# Altium schematic sheet STM.SchDoc
size A4
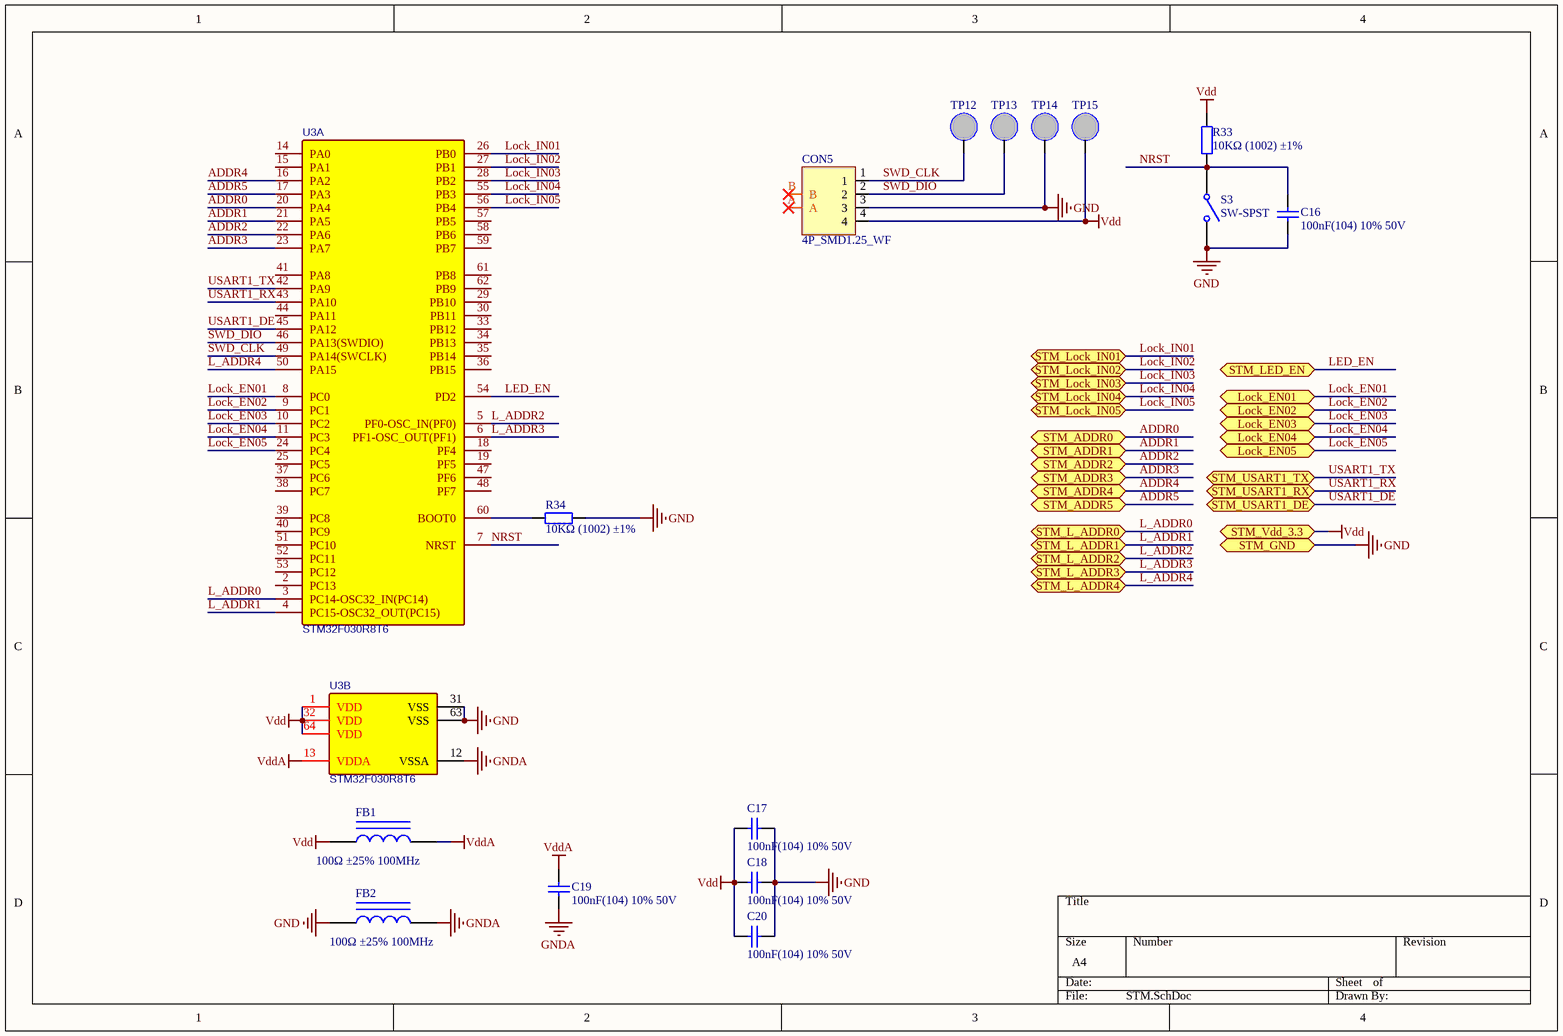
[diagram p0: STM.SchDoc]

## Parts
C16  100nF(104) 10% 50V  [0805_C]
C17  100nF(104) 10% 50V  [0805_C]
C18  100nF(104) 10% 50V  [0805_C]
C19  100nF(104) 10% 50V  [0805_C]
C20  100nF(104) 10% 50V  [0805_C]
CON5  4P_SMD1.25_WF  [MX 1.25-LS-4P]
FB1  100Ω ±25% 100MHz  [0805_L]
FB2  100Ω ±25% 100MHz  [0805_L]
R33  10KΩ (1002) ±1%  [0805_R]
R34  10KΩ (1002) ±1%  [0805_R]
S3  SW-SPST  [key]
TP12  TP  [TP]  (value not drawn)
TP13  TP  [TP]  (value not drawn)
TP14  TP  [TP]  (value not drawn)
TP15  TP  [TP]  (value not drawn)
U3  STM32F030R8T6  [LQFP-64_10X10X05P]  (parts A,B of 2)

## Ports
Lock_EN01, Lock_EN02, Lock_EN03, Lock_EN04, Lock_EN05, STM_ADDR0, STM_ADDR1, STM_ADDR2, STM_ADDR3, STM_ADDR4, STM_ADDR5, STM_GND, STM_L_ADDR0, STM_L_ADDR1, STM_L_ADDR2, STM_L_ADDR3, STM_L_ADDR4, STM_LED_EN, STM_Lock_IN01, STM_Lock_IN02, STM_Lock_IN03, STM_Lock_IN04, STM_Lock_IN05, STM_USART1_DE, STM_USART1_RX, STM_USART1_TX, STM_Vdd_3.3

## Nets
GND: C16.1 C17.1 C18.1 C20.1 CON5.3 FB2.1 R34.2 S3.2(NO) TP14.1 U3.31(VSS) U3.63(VSS) ; port STM_GND
GNDA: C19.1 FB2.2 U3.12(VSSA)
Vdd: C17.2 C18.2 C20.2 CON5.4 FB1.1 R33.2 TP15.1 U3.1(VDD) U3.32(VDD) U3.64(VDD) ; port STM_Vdd_3.3
VddA: C19.2 FB1.2 U3.13(VDDA)
ADDR0: U3.20(PA4) ; port STM_ADDR0
ADDR1: U3.21(PA5) ; port STM_ADDR1
ADDR2: U3.22(PA6) ; port STM_ADDR2
ADDR3: U3.23(PA7) ; port STM_ADDR3
ADDR4: U3.16(PA2) ; port STM_ADDR4
ADDR5: U3.17(PA3) ; port STM_ADDR5
L_ADDR0: U3.3(PC14-OSC32_IN(PC14)) ; port STM_L_ADDR0
L_ADDR1: U3.4(PC15-OSC32_OUT(PC15)) ; port STM_L_ADDR1
L_ADDR2: U3.5(PF0-OSC_IN(PF0)) ; port STM_L_ADDR2
L_ADDR3: U3.6(PF1-OSC_OUT(PF1)) ; port STM_L_ADDR3
L_ADDR4: U3.50(PA15) ; port STM_L_ADDR4
LED_EN: U3.54(PD2) ; port STM_LED_EN
Lock_EN01: U3.8(PC0) ; port Lock_EN01
Lock_EN02: U3.9(PC1) ; port Lock_EN02
Lock_EN03: U3.10(PC2) ; port Lock_EN03
Lock_EN04: U3.11(PC3) ; port Lock_EN04
Lock_EN05: U3.24(PC4) ; port Lock_EN05
Lock_IN01: U3.26(PB0) ; port STM_Lock_IN01
Lock_IN02: U3.27(PB1) ; port STM_Lock_IN02
Lock_IN03: U3.28(PB2) ; port STM_Lock_IN03
Lock_IN04: U3.55(PB3) ; port STM_Lock_IN04
Lock_IN05: U3.56(PB4) ; port STM_Lock_IN05
NRST: C16.2 R33.1 S3.1(COMMON) U3.7(NRST)
SWD_CLK: CON5.1 TP12.1 U3.49(PA14(SWCLK))
SWD_DIO: CON5.2 TP13.1 U3.46(PA13(SWDIO))
USART1_DE: U3.45(PA12) ; port STM_USART1_DE
USART1_RX: U3.43(PA10) ; port STM_USART1_RX
USART1_TX: U3.42(PA9) ; port STM_USART1_TX
NetR34_1: R34.1 U3.60(BOOT0)

Not connected (* = marked no-connect by the designer): CON5 A* B*; U3 2(PC13) 14(PA0) 15(PA1) 18(PF4) 19(PF5) 25(PC5) 29(PB10) 30(PB11) 33(PB12) 34(PB13) 35(PB14) 36(PB15) 37(PC6) 38(PC7) 39(PC8) 40(PC9) 41(PA8) 44(PA11) 47(PF6) 48(PF7) 51(PC10) 52(PC11) 53(PC12) 57(PB5) 58(PB6) 59(PB7) 61(PB8) 62(PB9)

## Library data of the parts
C16-C20 = 0805 100nF(104) 10% 50V: 贴片电容; ComponentLink1Description: 供应商链接; ComponentLink1URL: http://www.szlcsc.com/product/details_50686.html; Package: 0805; Supplier: LC; SuppliersPartNumber: C49678
CON5 = 4P_XH2.54_W
FB1 FB2 = 0805 100Ω 25% 100MHz: 贴片磁珠; ComponentLink1Description: 供应商链接; ComponentLink1URL: http://www.szlcsc.com/product/details_1367.html; Package: 0805; Supplier: LC; SuppliersPartNumber: C1015
R33 R34 = 0805 10KΩ (1002) 1%: 贴片电阻; ComponentLink1Description: 供应商链接; ComponentLink1URL: http://www.szlcsc.com/product/details_18102.html; Package: 0805; Supplier: LC; SuppliersPartNumber: C17414
S3 = SW-SPST: Single-Pole, Single-Throw Switch; Published: 24-Mar-1999; LatestRevisionDate: 17-Jul-2002; LatestRevisionNote: Re-released for DXP Platform.; PackageReference: SPST-2; Publisher: Altium Limited; PackageDescription: Switch; 2 Leads
U3 = STM32F030R8T6: BOM_Manufacturer: ST; subpart_no: 1; tags: STM32; BOM_Supplier Part: C39105; BOM_Supplier: LCSC; BOM_Manufacturer Part: STM32F030R8T6; image: http://image.lceda.cn/szlcsc/C39105.jpg; spicePre: U